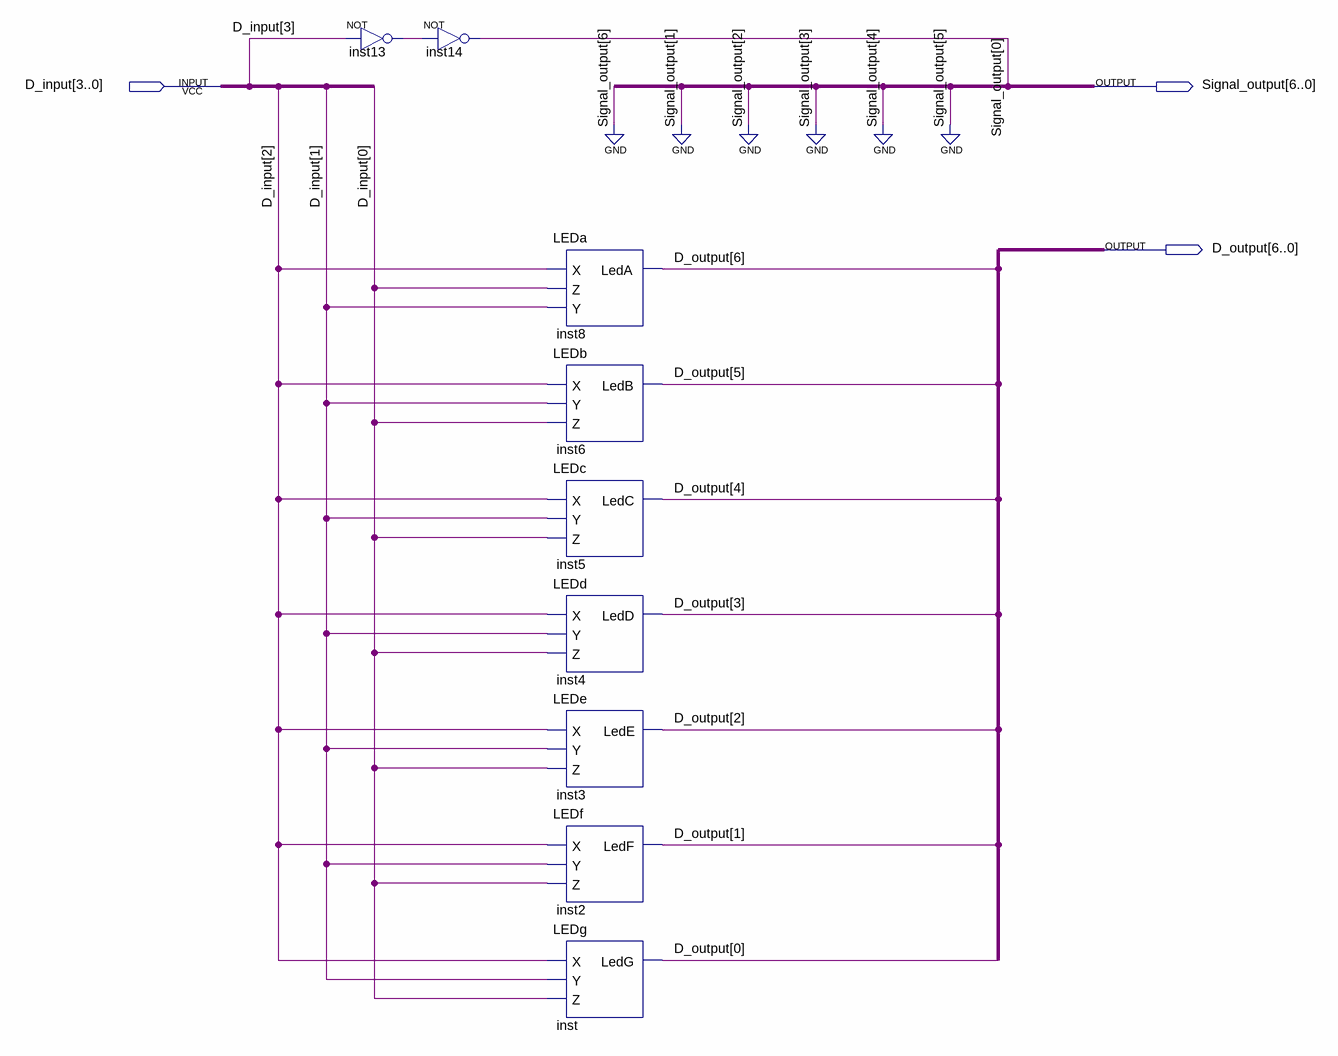
[diagram p0: schematic sheet]
// Quartus schematic DisplayULA.bdf as structural Verilog: 9 symbols, 3 pins
module DisplayULA (
  input  [3:0] D_input,
  output [6:0] Signal_output,
  output [6:0] D_output
);

  wire inst13_out;

  not inst13 (inst13_out, D_input[3]);
  not inst14 (Signal_output[0], inst13_out);
  LEDa inst8 (.X(D_input[2]), .Z(D_input[0]), .Y(D_input[1]), .LedA(D_output[6]));
  LEDb inst6 (.X(D_input[2]), .Y(D_input[1]), .Z(D_input[0]), .LedB(D_output[5]));
  LEDc inst5 (.X(D_input[2]), .Y(D_input[1]), .Z(D_input[0]), .LedC(D_output[4]));
  LEDd inst4 (.X(D_input[2]), .Y(D_input[1]), .Z(D_input[0]), .LedD(D_output[3]));
  LEDe inst3 (.X(D_input[2]), .Y(D_input[1]), .Z(D_input[0]), .LedE(D_output[2]));
  LEDf inst2 (.X(D_input[2]), .Y(D_input[1]), .Z(D_input[0]), .LedF(D_output[1]));
  LEDg inst (.X(D_input[2]), .Y(D_input[1]), .Z(D_input[0]), .LedG(D_output[0]));

  assign Signal_output[6:1] = {6{1'b0}};
endmodule
